# Altium schematic sheet Power.SchDoc
size A3; SheetNumber: 3; SheetTotal: 12
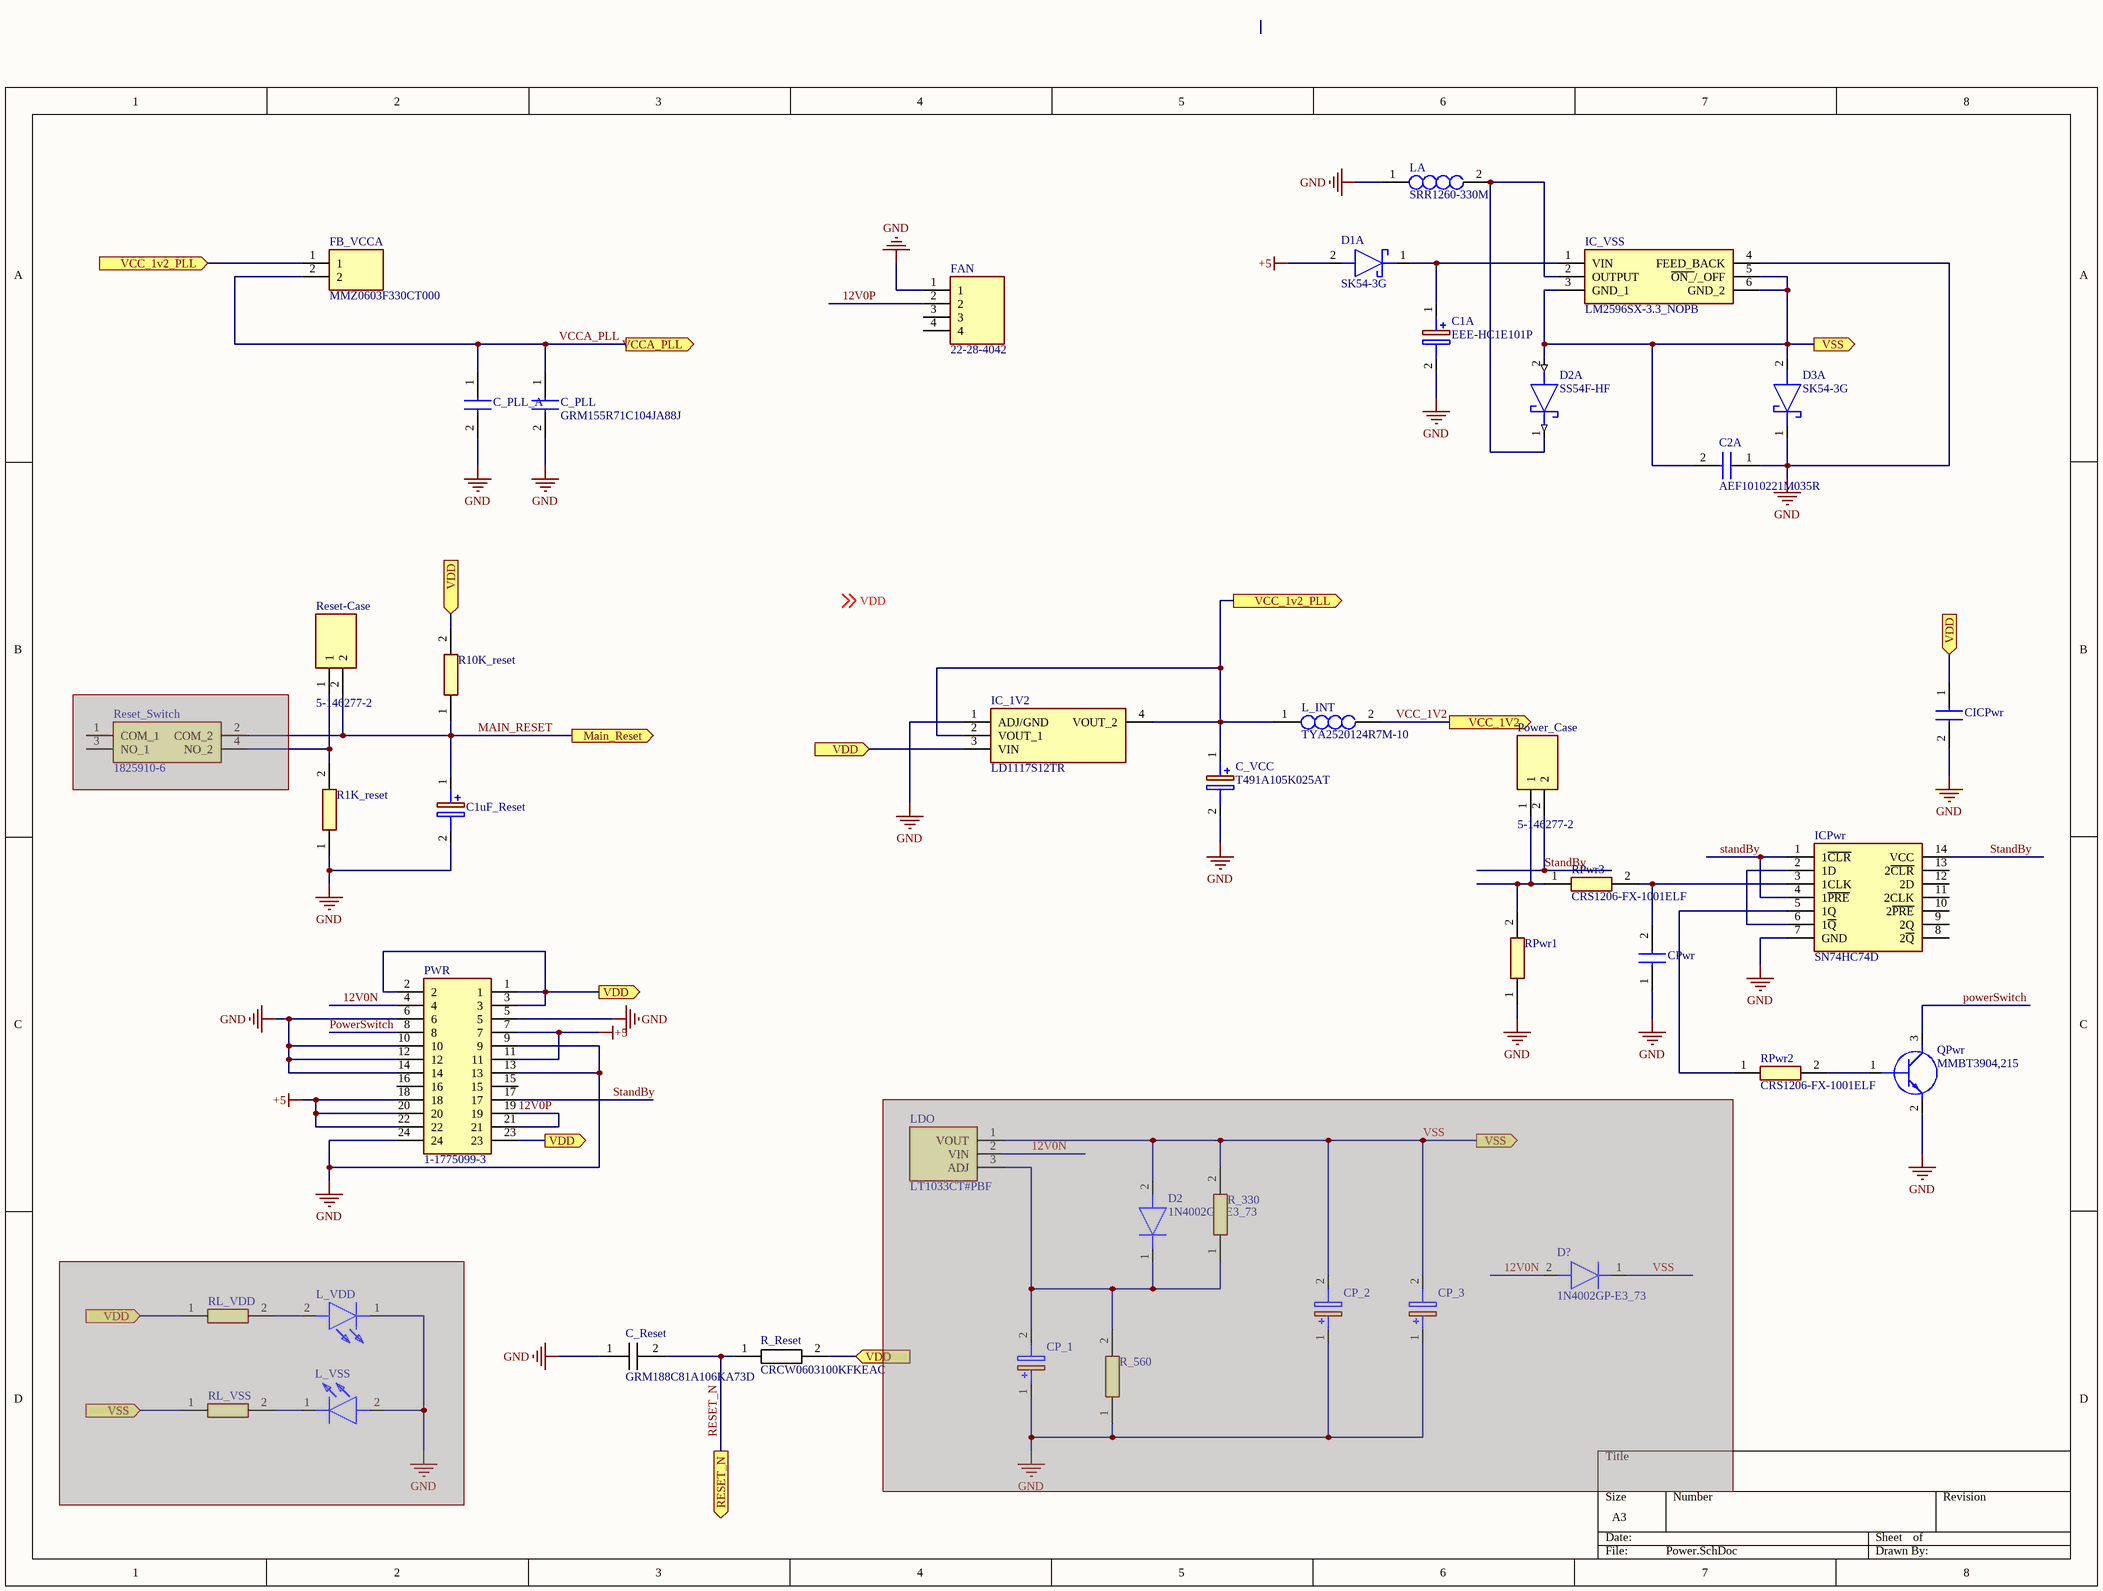
[diagram p0: Power.SchDoc]

## Parts
C1A  EEE-HC1E101P  [EEHZT1E331UP]
C1uF_Reset  EDH105M050A9BAA  [CAPAE430X565N]  (value not drawn)
C2A  AEF1010221M035R  [CAPAE1030X1050N]
C_PLL  GRM155R71C104JA88J  [CAPC1005X55N]
C_PLL_A  C0805X475J3RACAUTO7210  [CAPC2012X145N]  (value not drawn)
C_Reset  GRM188C81A106KA73D  [CAPC1608X90N]
C_VCC  T491A105K025AT  [T491A]
CICPwr  GRM155R71C104JA88D  [CAPC1005X55N]  (value not drawn)
CP_1  860020472003  [CAPPRD200W52D500H1250]  (value not drawn)  (masked out: inside a compile mask, not in the netlist)
CP_2  TAP225K035CRW  [TAP225K035CRW]  (value not drawn)  (masked out: inside a compile mask, not in the netlist)
CP_3  ECA-1EM102  [CAPPRD500W65D1025H2200]  (value not drawn)  (masked out: inside a compile mask, not in the netlist)
CPwr  C0603X103G5JACTU  [C0603]  (value not drawn)
D1A  SK54-3G  [DIOM5437X240N]
D2  1N4002GP-E3_73  [DIOAD1405W86L465D235]  (masked out: inside a compile mask, not in the netlist)
D2A  SS54F-HF  [SODFL4626X120N]
D3A  SK54-3G  [DIOM5437X240N]
D?  1N4002GP-E3_73  [DIOAD1405W86L465D235]  (masked out: inside a compile mask, not in the netlist)
FAN  22-28-4042  [HDRV4W66P0X254_1X4_1016X249X1003P]
FB_VCCA  MMZ0603F330CT000  [BEADC0603X33N]
IC_1V2  LD1117S12TR  [SOT230P700X180-4N]
IC_VSS  LM2596SX-3.3_NOPB  [KTT0005B]
ICPwr  SN74HC74D  [SOIC127P600X175-14N]
L_INT  TYA2520124R7M-10  [TYA2520124R7M10]
L_VDD  150060VS55040  [LEDM168X50N]  (value not drawn)  (masked out: inside a compile mask, not in the netlist)
L_VSS  150060SS75003  [150060SS75003]  (value not drawn)  (masked out: inside a compile mask, not in the netlist)
LA  SRR1260-330M  [SRR1260-150M]
LDO  LT1033CT#PBF  [TO254P457X1022X2266-3P]  (masked out: inside a compile mask, not in the netlist)
Power_Case  5-146277-2  [HDRV2W67P0X254_1X2_467X234X823P]
PWR  1-1775099-3  [1-1775099-3]
QPwr  MMBT3904,215  [MMBT3904215]
R1K_reset  RCS06031K00FKEA  [RESC1608X50N]  (value not drawn)
R10K_reset  RCS060310K0JNEA  [RCS0603_E3]  (value not drawn)
R_330  OK3315E-R52  [RESAD1680W64L680D250]  (value not drawn)  (masked out: inside a compile mask, not in the netlist)
R_560  OK5615E-R52  [RESAD1680W64L680D250]  (value not drawn)  (masked out: inside a compile mask, not in the netlist)
R_Reset  CRCW0603100KFKEAC  [RESC1608X55N]
Reset-Case  5-146277-2  [HDRV2W67P0X254_1X2_467X234X823P]
Reset_Switch  1825910-6  [18259106]  (masked out: inside a compile mask, not in the netlist)
RL_VDD  CRCW06031K00JNEAC  [RESC1608X55N]  (value not drawn)  (masked out: inside a compile mask, not in the netlist)
RL_VSS  CRCW06031K00JNEAC  [RESC1608X55N]  (value not drawn)  (masked out: inside a compile mask, not in the netlist)
RPwr1  CRS1206QFX-1002ELF  [RESC3116X65N]  (value not drawn)
RPwr2  CRS1206-FX-1001ELF  [RESC3116X65N]
RPwr3  CRS1206-FX-1001ELF  [RESC3116X65N]

## Ports
Main_Reset (out), RESET_N (out), VCC_1V2 (out), VCC_1v2_PLL (in), VCC_1v2_PLL (out), VCCA_PLL (out), VDD (in), VDD (out), VSS (in), VSS (out)

## Nets
+5: D1A.2(A) PWR.7 PWR.11 PWR.18 PWR.20 PWR.22
GND: C1A.2(-) C1uF_Reset.2(-) C2A.1(+) C_PLL.2 C_PLL_A.2 C_Reset.1 C_VCC.2(-) CICPwr.2 CPwr.1 D3A.1(K) FAN.1 IC_1V2.1(ADJ/GND) IC_VSS.4(FEED_BACK) ICPwr.7(GND) LA.1 PWR.5 PWR.6 PWR.9 PWR.10 PWR.12 PWR.13 PWR.14 PWR.24 QPwr.2(E) R1K_reset.1 RPwr1.1
12V0N: PWR.4
12V0P: FAN.2 PWR.19 PWR.21
MAIN_RESET: C1uF_Reset.1(+) R10K_reset.1 Reset-Case.2 ; port Main_Reset
PowerSwitch: PWR.8 QPwr.3(C)
RESET_N: C_Reset.2 R_Reset.1 ; port RESET_N
StandBy: ICPwr.1(1~{CLR}) ICPwr.4(1~{PRE}) ICPwr.14(VCC) Power_Case.2 PWR.17
VCC_1V2: L_INT.2 ; port VCC_1V2
VCC_1v2_PLL: C_VCC.1(+) FB_VCCA.1 IC_1V2.2(VOUT_1) IC_1V2.4(VOUT_2) L_INT.1 ; port VCC_1v2_PLL
VCCA_PLL: C_PLL.1 C_PLL_A.1 FB_VCCA.2 ; port VCCA_PLL
VDD: CICPwr.1 IC_1V2.3(VIN) PWR.1 PWR.2 PWR.3 PWR.23 R10K_reset.2 R_Reset.2 ; port VDD
VSS: C2A.2(-) D2A.2(A) D3A.2(A) IC_VSS.3(GND_1) IC_VSS.5(~{ON_}/_OFF) IC_VSS.6(GND_2) ; port VSS
NetC1A_1: C1A.1(+) D1A.1(K) IC_VSS.1(VIN)
NetCPwr_2: CPwr.2 ICPwr.3(1CLK) RPwr3.2
NetD2A_1: D2A.1(K) IC_VSS.2(OUTPUT) LA.2
NetICPwr_2: ICPwr.2(1D) ICPwr.6(1~{Q})
NetICPwr_5: ICPwr.5(1Q) RPwr2.1
NetPower_Case_1: Power_Case.1 RPwr1.2 RPwr3.1
NetQPwr_1: QPwr.1(B) RPwr2.2
NetR1K_reset_2: R1K_reset.2 Reset-Case.1

Not connected (* = marked no-connect by the designer): FAN 3 4; ICPwr 8(2~{Q}) 9(2Q) 10(2~{PRE}) 11(2CLK) 12(2D) 13(2~{CLR}); PWR 15 16

## Notes on the sheet
- Labels drawn without touching a wire or pin: VDD

## Library data of the parts
C1A = EEE-HC1E101P: Capacitor Polarised; Manufacturer_Name: Panasonic; Datasheet Link: http://industrial.panasonic.com/cdbs/www-data/pdf/RDE0000/ABA0000C1160.pdf; Height: 10.8mm; Manufacturer_Part_Number: EEE-HC1E101P; Mouser Part Number: 667-EEE-HC1E101P; Mouser Price/Stock: https://www.mouser.com/Search/Refine.aspx?Keyword=667-EEE-HC1E101P; Arrow Part Number: EEE-HC1E101P; Arrow Price/Stock: https://www.arrow.com/en/products/eee-hc1e101p/panasonic
C1uF_Reset = EDH105M050A9BAA: Capacitor Polarised; Manufacturer_Name: KEMET; Datasheet Link: https://content.kemet.com/datasheets/KEM_A4049_EDH.pdf; Height: 5.65mm; Manufacturer_Part_Number: EDH105M050A9BAA; Mouser Part Number: 80-EDH105M050A9BAA; Mouser Price/Stock: https://www.mouser.co.uk/ProductDetail/KEMET/EDH105M050A9BAA?qs=E9QF1UCAUX56DBSFGzxVeg%3D%3D; Arrow Part Number: EDH105M050A9BAA; Arrow Price/Stock: https://www.arrow.com/en/products/edh105m050a9baa/kemet-corporation?region=europe
C2A = AEF1010221M035R: Capacitor; Manufacturer_Name: Kyocera AVX; Datasheet Link: https://br.mouser.com/datasheet/2/40/kyocera_avx_aef_series-2933561.pdf; Height: 10.5mm; Manufacturer_Part_Number: AEF1010221M035R
C_PLL = GRM155R71C104JA88J: Capacitor; Manufacturer_Name: Murata Electronics; Datasheet Link: http://www.murata.com/~/media/webrenewal/support/library/catalog/products/capacitor/mlcc/c02e.pdf; Height: 0.55mm; Manufacturer_Part_Number: GRM155R71C104JA88J; Mouser Part Number: 81-GRM155R71C104JA8J; Mouser Price/Stock: https://www.mouser.co.uk/ProductDetail/Murata-Electronics/GRM155R71C104JA88J?qs=hNud%2FORuBR1FShEh%252B0yzMw%3D%3D; Arrow Part Number: GRM155R71C104JA88J; Arrow Price/Stock: https://www.arrow.com/en/products/grm155r71c104ja88j/murata-manufacturing?region=nac
C_PLL_A = C0805X475J3RACAUTO7210: Capacitor; Manufacturer_Name: KEMET; Datasheet Link: https://www.kemet.com/specsheet/C0805X475J3RACAUTO7210; Height: 1.45mm; Manufacturer_Part_Number: C0805X475J3RACAUTO7210; Mouser Part Number: 80-C0805X475J3RAUTLR; Mouser Price/Stock: https://www.mouser.co.uk/ProductDetail/KEMET/C0805X475J3RACAUTO7210?qs=%252B6g0mu59x7KZNSFSYLExgg%3D%3D
C_Reset = GRM188C81A106KA73D: Capacitor; Manufacturer_Name: Murata Electronics; Datasheet Link: http://componentsearchengine.com/Datasheets/1/GRM188C81A106KA73D.pdf; Height: 0.9mm; Manufacturer_Part_Number: GRM188C81A106KA73D; Mouser Part Number: 81-GRM188C81A106KA3D; Mouser Price/Stock: https://www.mouser.com/Search/Refine.aspx?Keyword=81-GRM188C81A106KA3D; Arrow Part Number: GRM188C81A106KA73D; Arrow Price/Stock: https://www.arrow.com/en/products/grm188c81a106ka73d/murata-manufacturing
C_VCC = T491A105K025AT: Capacitor Polarised; Manufacturer_Name: KEMET; Datasheet Link: https://content.kemet.com/datasheets/KEM_T2005_T491.pdf; Height: 1.8mm; Manufacturer_Part_Number: T491A105K025AT; Mouser Part Number: 80-T491A105K025; Mouser Price/Stock: https://www.mouser.co.uk/ProductDetail/KEMET/T491A105K025AT?qs=VCf6WUQjPgGa9NtfaqeN%252Bg%3D%3D; Arrow Part Number: T491A105K025AT; Arrow Price/Stock: https://www.arrow.com/en/products/t491a105k025at/kemet-corporation?region=nac
CICPwr = GRM155R71C104JA88D: Capacitor; Manufacturer_Name: Murata Electronics; Datasheet Link: http://www.murata.com/~/media/webrenewal/support/library/catalog/products/capacitor/mlcc/c02e.pdf; Height: 0.55mm; Manufacturer_Part_Number: GRM155R71C104JA88D; Mouser Part Number: 81-GRM155R71C104JA8D; Mouser Price/Stock: https://www.mouser.co.uk/ProductDetail/Murata-Electronics/GRM155R71C104JA88D?qs=pwh76yelNxDjPOceoz6xEg%3D%3D; Arrow Part Number: GRM155R71C104JA88D; Arrow Price/Stock: https://www.arrow.com/en/products/grm155r71c104ja88d/murata-manufacturing?region=nac
CP_1 = 860020472003: Capacitor Polarised; Manufacturer_Name: Wurth Elektronik; Datasheet Link: https://katalog.we-online.com/pbs/datasheet/860020472003.pdf; Height: 12.5mm; Manufacturer_Part_Number: 860020472003; Mouser Part Number: 710-860020472003; Mouser Price/Stock: https://www.mouser.co.uk/ProductDetail/Wurth-Elektronik/860020472003?qs=0KOYDY2FL2800BT4CoOrXQ%3D%3D
CP_2 = TAP225K035CRW: Capacitor Polarised; Manufacturer_Name: AVX; Datasheet Link: https://datasheets.kyocera-avx.com/tap.pdf; Height: 9mm; Manufacturer_Part_Number: TAP225K035CRW
CP_3 = ECA-1EM102: Capacitor Polarised; Manufacturer_Name: Panasonic; Datasheet Link: http://industrial.panasonic.com/cdbs/www-data/pdf/RDF0000/ABA0000C1218.pdf; Height: 22mm; Manufacturer_Part_Number: ECA-1EM102; Mouser Part Number: 667-ECA-1EM102; Mouser Price/Stock: https://www.mouser.com/Search/Refine.aspx?Keyword=667-ECA-1EM102
CPwr = C0603X103G5JACTU: Capacitor; Manufacturer_Name: KEMET; Datasheet Link: https://content.kemet.com/datasheets/KEM_C1087_U2J_FT-CAP_SMD.pdf; Height: 0.87mm; Manufacturer_Part_Number: C0603X103G5JACTU; Mouser Part Number: 80-C0603X103G5J; Mouser Price/Stock: https://www.mouser.co.uk/ProductDetail/KEMET/C0603X103G5JACTU/?qs=rKqJIm0tnYFz51SLsN%252BFYQ%3D%3D; Arrow Part Number: C0603X103G5JACTU; Arrow Price/Stock: https://www.arrow.com/en/products/c0603x103g5jactu/kemet-corporation
D1A D3A = SK54-3G: Schottky Diode; Manufacturer_Name: Diotec; Datasheet Link: https://diotec.com/request/datasheet/sk54-3g.pdf; Height: 2.4mm; Manufacturer_Part_Number: SK54-3G; Mouser Part Number: 637-SK54-3G; Mouser Price/Stock: https://www.mouser.co.uk/ProductDetail/Diotec-Semiconductor/SK54-3G?qs=OlC7AqGiEDkfzpeKJrtneQ%3D%3D; Arrow Part Number: SK54-3G; Arrow Price/Stock: https://www.arrow.com/en/products/sk54-3g/diotec-semiconductor-ag?region=asia
D2 D? = 1N4002GP-E3_73: Diode; Manufacturer_Name: Vishay; Manufacturer_Part_Number: 1N4002GP-E3/73; Datasheet Link: https://www.arrow.com/en/products/1n4002gp-e373/vishay; Mouser Part Number: 625-1N4002GP-E3/73; Mouser Price/Stock: https://www.mouser.co.uk/ProductDetail/Vishay-General-Semiconductor/1N4002GP-E3-73?qs=N4vtoAxH%2FSqHH%252BCA02W8mw%3D%3D; Arrow Part Number: 1N4002GP-E3/73; Arrow Price/Stock: https://www.arrow.com/en/products/1n4002gp-e373/vishay
D2A = SS54F-HF: Schottky Diode; Manufacturer_Name: Comchip Technology; Datasheet Link: http://www.comchiptech.com/admin/files/product/20190806174558.pdf; Height: 1.2mm; Manufacturer_Part_Number: SS54F-HF; Mouser Part Number: 750-SS54F-HF; Mouser Price/Stock: https://www.mouser.co.uk/ProductDetail/Comchip-Technology/SS54F-HF?qs=GBLSl2Akirv9e2Io%252BmNS2w%3D%3D; Arrow Part Number: SS54F-HF; Arrow Price/Stock: https://www.arrow.com/en/products/ss54f-hf/comchip-technology?region=nac
FAN = 22-28-4042: Connector; Manufacturer_Name: Molex; Datasheet Link: https://www.molex.com/content/dam/molex/molex-dot-com/products/automated/en-us/salesdrawingpdf/423/42375/022284042_sd.pdf?inline; Height: 10.03mm; Manufacturer_Part_Number: 22-28-4042; Mouser Part Number: 538-22-28-4042; Mouser Price/Stock: https://www.mouser.co.uk/ProductDetail/Molex/22-28-4042?qs=GAPJcf4kvdu6DqYOOlzdaQ%3D%3D
FB_VCCA = MMZ0603F330CT000: Ferrite Bead; Manufacturer_Name: TDK; Datasheet Link: https://product.tdk.com/system/files/dam/doc/product/emc/emc/beads/catalog/beads_commercial_signal_mmz0603_en.pdf; Height: 0.33mm; Manufacturer_Part_Number: MMZ0603F330CT000; Mouser Part Number: 810-MMZ0603F330CT000; Mouser Price/Stock: https://www.mouser.co.uk/ProductDetail/TDK/MMZ0603F330CT000?qs=8Kz9Wu9QwqXBIC8npmRUAg%3D%3D
IC_1V2 = LD1117S12TR: Integrated Circuit; Manufacturer_Name: STMicroelectronics; Datasheet Link: http://www.st.com/st-web-ui/static/active/en/resource/technical/document/datasheet/CD00000544.pdf; Height: 1.8mm; Manufacturer_Part_Number: LD1117S12TR; Mouser Part Number: 511-LD1117S12; Mouser Price/Stock: https://www.mouser.co.uk/ProductDetail/STMicroelectronics/LD1117S12TR?qs=61zNq1xPlVSs7%252BqGq4VslA%3D%3D; Arrow Part Number: LD1117S12TR; Arrow Price/Stock: https://www.arrow.com/en/products/ld1117s12tr/stmicroelectronics?region=nac
IC_VSS = LM2596SX-3.3_NOPB: Integrated Circuit; Manufacturer_Name: Texas Instruments; Manufacturer_Part_Number: LM2596SX-3.3/NOPB; Datasheet Link: http://www.ti.com/lit/gpn/lm2596; Mouser Part Number: 926-LM2596SX33NOPB; Mouser Price/Stock: https://www.mouser.co.uk/ProductDetail/Texas-Instruments/LM2596SX-3.3-NOPB?qs=X1J7HmVL2ZEm4UYTFC0WWA%3D%3D; Arrow Part Number: LM2596SX-3.3/NOPB; Arrow Price/Stock: https://www.arrow.com/en/products/lm2596sx-3.3nopb/texas-instruments?utm_currency=USD&region=nac
ICPwr = SN74HC74D: Integrated Circuit; Manufacturer_Name: Texas Instruments; Datasheet Link: http://www.ti.com/lit/gpn/sn74hc74; Height: 1.75mm; Manufacturer_Part_Number: SN74HC74D; Mouser Part Number: 595-SN74HC74D; Mouser Price/Stock: https://www.mouser.co.uk/ProductDetail/Texas-Instruments/SN74HC74D?qs=p6YqzpSxLIzsMi9OHpAhoA%3D%3D; Arrow Part Number: SN74HC74D; Arrow Price/Stock: https://www.arrow.com/en/products/sn74hc74d/texas-instruments?region=nac
L_INT = TYA2520124R7M-10: Inductor; Manufacturer_Name: Laird Performance Materials; Datasheet Link: https://www.mouser.com/datasheet/2/987/TYA252012_series_(Rev_A)-1864563.pdf; Height: 1.35mm; Manufacturer_Part_Number: TYA2520124R7M-10; Mouser Part Number: 739-TYA2520124R7M-10; Mouser Price/Stock: https://www.mouser.co.uk/ProductDetail/Laird-Performance-Materials/TYA2520124R7M-10?qs=sPbYRqrBIVn5urejTQMtvg%3D%3D
L_VDD = 150060VS55040: LED; Manufacturer_Name: Wurth Elektronik; Datasheet Link: https://katalog.we-online.com/led/datasheet/150060VS55040.pdf; Height: 0.5mm; Manufacturer_Part_Number: 150060VS55040; Mouser Part Number: 710-150060VS55040; Mouser Price/Stock: https://www.mouser.co.uk/ProductDetail/Wurth-Elektronik/150060VS55040?qs=8Aam6%252B7C6HEumg%252B0cJZzvA%3D%3D
L_VSS = 150060SS75003: LED; Manufacturer_Name: Wurth Elektronik; Datasheet Link: https://www.we-online.com/catalog/datasheet/150060SS75003.pdf; Height: 0.8mm; Manufacturer_Part_Number: 150060SS75003; Mouser Part Number: 710-150060SS75003; Mouser Price/Stock: https://www.mouser.co.uk/ProductDetail/Wurth-Elektronik/150060SS75003?qs=Li%252BoUPsLEntNiRmIe%252Bnzlg%3D%3D
LA = SRR1260-330M: Inductor; Manufacturer_Name: Bourns; Datasheet Link: https://www.bourns.com/docs/Product-Datasheets/SRR1260.pdf; Manufacturer_Part_Number: SRR1260-330M; Mouser Part Number: 652-SRR1260-330M; Mouser Price/Stock: https://www.mouser.co.uk/ProductDetail/Bourns/SRR1260-330M?qs=R2jSSvul3fC3V4%252BTrq0P0w%3D%3D; Arrow Part Number: SRR1260-330M; Arrow Price/Stock: https://www.arrow.com/en/products/srr1260-330m/bourns?utm_currency=USD&region=nac
LDO = LT1033CT#PBF: Integrated Circuit; Manufacturer_Name: Analog Devices; Datasheet Link: https://www.analog.com/media/en/technical-documentation/data-sheets/1033fd.pdf; Height: 4.572mm; Manufacturer_Part_Number: LT1033CT#PBF; Mouser Part Number: 584-LT1033CT#PBF; Mouser Price/Stock: https://www.mouser.com/Search/Refine.aspx?Keyword=584-LT1033CT%23PBF; Arrow Part Number: LT1033CT#PBF; Arrow Price/Stock: https://www.arrow.com/en/products/lt1033ctpbf/analog-devices
Power_Case Reset-Case = 5-146277-2: Connector; Manufacturer_Name: TE Connectivity; Datasheet Link: https://www.te.com/commerce/DocumentDelivery/DDEController?Action=srchrtrv&DocNm=146277&DocType=Customer+Drawing&DocLang=English; Height: 8.23mm; Manufacturer_Part_Number: 5-146277-2; Mouser Part Number: 571-5-146277-2; Mouser Price/Stock: https://www.mouser.co.uk/ProductDetail/TE-Connectivity/5-146277-2?qs=bwpFY26eRVdSYoepUea0uA%3D%3D; Arrow Part Number: 5-146277-2; Arrow Price/Stock: https://www.arrow.com/en/products/5-146277-2/te-connectivity?utm_currency=USD&region=nac
PWR = 1-1775099-3: Connector; Manufacturer_Name: TE Connectivity; Datasheet Link: http://www.te.com/commerce/DocumentDelivery/DDEController?Action=showdoc&DocId=Customer+Drawing%7F1775099%7FG%7Fpdf%7FEnglish%7FENG_CD_1775099_G.pdf%7F1-1775099-3; Manufacturer_Part_Number: 1-1775099-3; Mouser Part Number: 571-1-1775099-3; Mouser Price/Stock: https://www.mouser.co.uk/ProductDetail/TE-Connectivity/1-1775099-3?qs=28ld6GkVMjRzvehyCXdQkg%3D%3D; Arrow Part Number: 1-1775099-3; Arrow Price/Stock: https://www.arrow.com/en/products/1-1775099-3/te-connectivity?region=nac
QPwr = MMBT3904,215: Transistor BJT NPN; Manufacturer_Name: Nexperia; Datasheet Link: https://assets.nexperia.com/documents/data-sheet/MMBT3904.pdf; Height: 1.1mm; Manufacturer_Part_Number: MMBT3904,215; Mouser Part Number: 771-MMBT3904T/R; Mouser Price/Stock: https://www.mouser.co.uk/ProductDetail/Nexperia/MMBT3904215?qs=LOCUfHb8d9s%2FW6hzAJGDbw%3D%3D; Arrow Part Number: MMBT3904,215; Arrow Price/Stock: https://www.arrow.com/en/products/mmbt3904215/nexperia?utm_currency=USD&region=nac
R1K_reset = RCS06031K00FKEA: Resistor; Manufacturer_Name: Vishay; Datasheet Link: http://www.vishay.com/docs/20065/rcse3.pdf; Height: 0.5mm; Manufacturer_Part_Number: RCS06031K00FKEA; Mouser Part Number: 71-RCS06031K00FKEA; Mouser Price/Stock: https://www.mouser.co.uk/ProductDetail/Vishay-Dale/RCS06031K00FKEA?qs=NKmfXavxMaymZq%2F68Mdhcw%3D%3D; Arrow Part Number: RCS06031K00FKEA; Arrow Price/Stock: https://www.arrow.com/en/products/rcs06031k00fkea/vishay?region=nac
R10K_reset = RCS060310K0JNEA: Resistor; Manufacturer_Name: Vishay; Datasheet Link: https://www.vishay.com/docs/20065/rcse3.pdf; Manufacturer_Part_Number: RCS060310K0JNEA; Mouser Part Number: 71-RCS060310K0JNEA; Mouser Price/Stock: https://www.mouser.co.uk/ProductDetail/Vishay-Dale/RCS060310K0JNEA?qs=NKmfXavxMaxOSWu%252BIfGj8A%3D%3D; Arrow Part Number: RCS060310K0JNEA; Arrow Price/Stock: https://www.arrow.com/en/products/rcs060310k0jnea/vishay?region=nac
R_330 R_560 = OK3315E-R52: Resistor; Manufacturer_Name: Ohmite; Datasheet Link: https://www.alliedelec.com/m/d/7f961050c862e52d900c42b673f6b00a.pdf; Manufacturer_Part_Number: OK3315E-R52; Mouser Part Number: 588-OK3315E-R52; Mouser Price/Stock: https://www.mouser.co.uk/ProductDetail/Ohmite/OK3315E-R52?qs=AkUtuiJmyflNBr4QtOugqA%3D%3D
R_Reset = CRCW0603100KFKEAC: Resistor; Manufacturer_Name: Vishay; Datasheet Link: https://www.mouser.com/datasheet/2/427/crcwce3-1223726.pdf; Height: 0.55mm; Manufacturer_Part_Number: CRCW0603100KFKEAC; Mouser Part Number: 71-CRCW0603100KFKEAC; Mouser Price/Stock: https://www.mouser.co.uk/ProductDetail/Vishay-Dale/CRCW0603100KFKEAC?qs=E3Y5ESvWgWPxzfNYyMgX1w%3D%3D; Arrow Part Number: CRCW0603100KFKEAC; Arrow Price/Stock: https://www.arrow.com/en/products/crcw0603100kfkeac/vishay?region=nac
Reset_Switch = 1825910-6: Switch; Manufacturer_Name: TE Connectivity; Datasheet Link: https://www.te.com/commerce/DocumentDelivery/DDEController?Action=srchrtrv&DocNm=1825910&DocType=Customer+Drawing&DocLang=English&DocFormat=pdf&PartCntxt=1825910-6; Height: 5.3mm; Manufacturer_Part_Number: 1825910-6; Mouser Part Number: N/A; Mouser Price/Stock: https://www.mouser.co.uk/ProductDetail/TE-Connectivity/1825910-6?qs=A6cQTCBcXncisYDS1KbpGA%3D%3D; Arrow Part Number: 1825910-6; Arrow Price/Stock: https://www.arrow.com/en/products/1825910-6/te-connectivity?region=europe
RL_VDD RL_VSS = CRCW06031K00JNEAC: Resistor; Manufacturer_Name: Vishay; Datasheet Link: http://www.vishay.com/docs/28773/crcwce3.pdf; Height: 0.55mm; Manufacturer_Part_Number: CRCW06031K00JNEAC; Mouser Part Number: 71-CRCW06031K00JNEAC; Mouser Price/Stock: https://www.mouser.co.uk/ProductDetail/Vishay-Dale/CRCW06031K00JNEAC?qs=E3Y5ESvWgWPM5t3DlmyFHQ%3D%3D; Arrow Part Number: CRCW06031K00JNEAC; Arrow Price/Stock: https://www.arrow.com/en/products/crcw06031k00jneac/vishay?region=nac
RPwr1 = CRS1206QFX-1002ELF: Resistor; Manufacturer_Name: Bourns; Datasheet Link: http://www.bourns.com/docs/Product-Datasheets/CRS-Q.pdf; Height: 0.65mm; Manufacturer_Part_Number: CRS1206QFX-1002ELF; Mouser Part Number: 652-CRS1206QFX-1002E; Mouser Price/Stock: https://www.mouser.co.uk/ProductDetail/Bourns/CRS1206QFX-1002ELF?qs=8Wlm6%252BaMh8QKdvkWTPthtg%3D%3D; Arrow Part Number: CRS1206QFX-1002ELF; Arrow Price/Stock: https://www.arrow.com/en/products/crs1206qfx-1002elf/bourns?region=nac
RPwr2 RPwr3 = CRS1206-FX-1001ELF: Resistor; Manufacturer_Name: Bourns; Datasheet Link: http://uk.rs-online.com/web/p/products/8672962; Height: 0.65mm; Manufacturer_Part_Number: CRS1206-FX-1001ELF; Mouser Part Number: 652-CRS1206FX1001ELF; Mouser Price/Stock: https://www.mouser.co.uk/ProductDetail/Bourns/CRS1206-FX-1001ELF?qs=3ZbGupGMFUehf2oUUmM3wg%3D%3D; Arrow Part Number: CRS1206-FX-1001ELF; Arrow Price/Stock: https://www.arrow.com/en/products/crs1206-fx-1001elf/bourns?region=nac